# Altium schematic sheet elevator.SchDoc
size A4
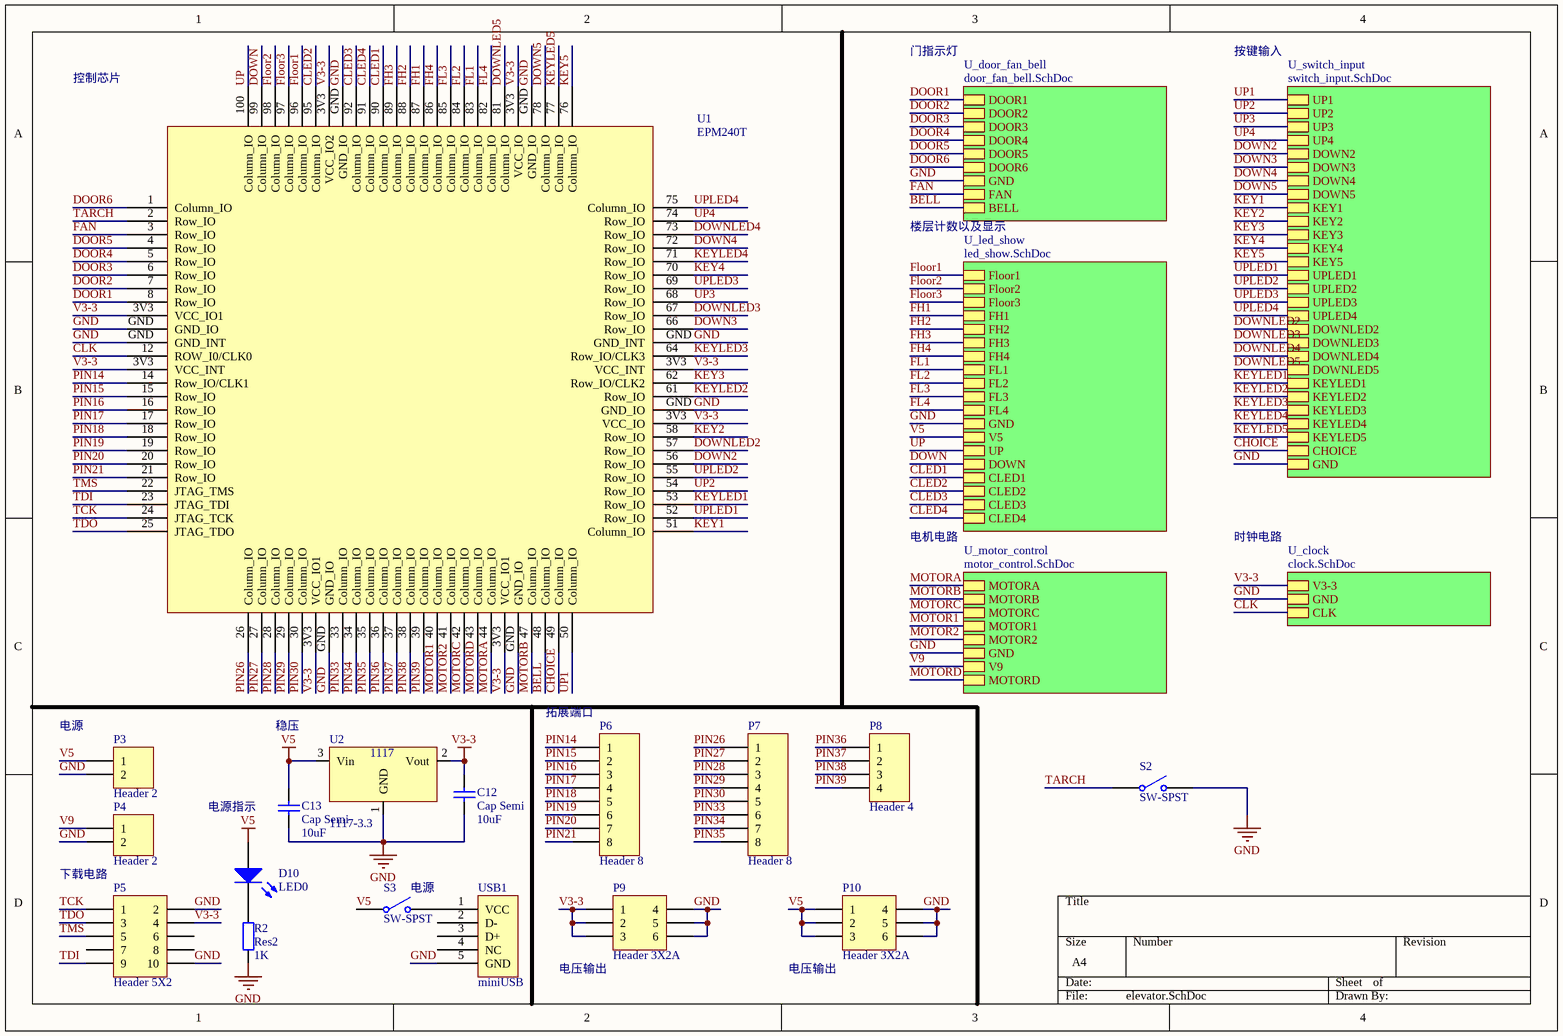
[diagram p0: elevator.SchDoc]

## Parts
C12  Cap Semi  value 10uF  [0603]
C13  Cap Semi  value 10uF  [0603]
D10  LED0  [1206]
P3  Header 2  [HDR1X2]
P4  Header 2  [HDR1X2]
P5  Header 5X2  [P_DC3]
P6  Header 8  [HDR1X8]
P7  Header 8  [HDR1X8]
P8  Header 4  [HDR1X4]
P9  Header 3X2A  [HDR2X3_CEN]
P10  Header 3X2A  [HDR2X3_CEN]
R2  Res2  value 1K  [0603]
S2  SW-SPST  [SW_TARCH]
S3  SW-SPST  [SIP3]
U1  EPM240T  [CPLD100]
U2  1117-3.3  [SOT-223]
USB1  miniUSB  [miniUSB]

## Sub-sheets
U_clock = clock.SchDoc: V3-3, GND, CLK
U_door_fan_bell = door_fan_bell.SchDoc: DOOR1, DOOR2, DOOR3, DOOR4, DOOR5, DOOR6, GND, FAN, BELL
U_led_show = led_show.SchDoc: Floor1, Floor2, Floor3, FH1, FH2, FH3, FH4, FL1, FL2, FL3, FL4, GND, V5, UP, DOWN, CLED1, CLED2, CLED3, CLED4
U_motor_control = motor_control.SchDoc: MOTORA, MOTORB, MOTORC, MOTOR1, MOTOR2, GND, V9, MOTORD
U_switch_input = switch_input.SchDoc: UP1, UP2, UP3, UP4, DOWN2, DOWN3, DOWN4, DOWN5, KEY1, KEY2, KEY3, KEY4, KEY5, UPLED1, UPLED2, UPLED3, UPLED4, DOWNLED2, DOWNLED3, DOWNLED4, DOWNLED5, KEYLED1, KEYLED2, KEYLED3, KEYLED4, KEYLED5, CHOICE, GND

## Nets
GND: C12.2 C13.2 P3.2 P4.2 P5.2 P5.10 P9.4 P9.5 P9.6 P10.4 P10.5 P10.6 R2.1 S2.2(NO) U1.GND(GND_IO) U2.1(GND) USB1.5(GND) ; sheet U_door_fan_bell/GND, sheet U_switch_input/GND, sheet U_clock/GND, sheet U_led_show/GND, sheet U_motor_control/GND
V3-3: C12.1 P5.4 P9.1 P9.2 P9.3 U1.3V3(VCC_IO1) U2.2(Vout) ; sheet U_clock/V3-3
V5: C13.1 D10.1(A) P3.1 P10.1 P10.2 P10.3 S3.1(COMMON) U2.3(Vin) ; sheet U_led_show/V5
BELL: U1.48(Column_IO) ; sheet U_door_fan_bell/BELL
CHOICE: U1.49(Column_IO) ; sheet U_switch_input/CHOICE
CLED1: U1.90(Column_IO) ; sheet U_led_show/CLED1
CLED2: U1.95(Column_IO) ; sheet U_led_show/CLED2
CLED3: U1.92(Column_IO) ; sheet U_led_show/CLED3
CLED4: U1.91(Column_IO) ; sheet U_led_show/CLED4
CLK: U1.12(ROW_I0/CLK0) ; sheet U_clock/CLK
DOOR1: U1.8(Row_IO) ; sheet U_door_fan_bell/DOOR1
DOOR2: U1.7(Row_IO) ; sheet U_door_fan_bell/DOOR2
DOOR3: U1.6(Row_IO) ; sheet U_door_fan_bell/DOOR3
DOOR4: U1.5(Row_IO) ; sheet U_door_fan_bell/DOOR4
DOOR5: U1.4(Row_IO) ; sheet U_door_fan_bell/DOOR5
DOOR6: U1.1(Column_IO) ; sheet U_door_fan_bell/DOOR6
DOWN: U1.99(Column_IO) ; sheet U_led_show/DOWN
DOWN2: U1.56(Row_IO) ; sheet U_switch_input/DOWN2
DOWN3: U1.66(Row_IO) ; sheet U_switch_input/DOWN3
DOWN4: U1.72(Row_IO) ; sheet U_switch_input/DOWN4
DOWN5: U1.78(Column_IO) ; sheet U_switch_input/DOWN5
DOWNLED2: U1.57(Row_IO) ; sheet U_switch_input/DOWNLED2
DOWNLED3: U1.67(Row_IO) ; sheet U_switch_input/DOWNLED3
DOWNLED4: U1.73(Row_IO) ; sheet U_switch_input/DOWNLED4
DOWNLED5: U1.81(Column_IO) ; sheet U_switch_input/DOWNLED5
FAN: U1.3(Row_IO) ; sheet U_door_fan_bell/FAN
FH1: U1.87(Column_IO) ; sheet U_led_show/FH1
FH2: U1.88(Column_IO) ; sheet U_led_show/FH2
FH3: U1.89(Column_IO) ; sheet U_led_show/FH3
FH4: U1.86(Column_IO) ; sheet U_led_show/FH4
FL1: U1.83(Column_IO) ; sheet U_led_show/FL1
FL2: U1.84(Column_IO) ; sheet U_led_show/FL2
FL3: U1.85(Column_IO) ; sheet U_led_show/FL3
FL4: U1.82(Column_IO) ; sheet U_led_show/FL4
Floor1: U1.96(Column_IO) ; sheet U_led_show/Floor1
Floor2: U1.98(Column_IO) ; sheet U_led_show/Floor2
Floor3: U1.97(Column_IO) ; sheet U_led_show/Floor3
KEY1: U1.51(Column_IO) ; sheet U_switch_input/KEY1
KEY2: U1.58(Row_IO) ; sheet U_switch_input/KEY2
KEY3: U1.62(Row_IO/CLK2) ; sheet U_switch_input/KEY3
KEY4: U1.70(Row_IO) ; sheet U_switch_input/KEY4
KEY5: U1.76(Column_IO) ; sheet U_switch_input/KEY5
KEYLED1: U1.53(Row_IO) ; sheet U_switch_input/KEYLED1
KEYLED2: U1.61(Row_IO) ; sheet U_switch_input/KEYLED2
KEYLED3: U1.64(Row_IO/CLK3) ; sheet U_switch_input/KEYLED3
KEYLED4: U1.71(Row_IO) ; sheet U_switch_input/KEYLED4
KEYLED5: U1.77(Column_IO) ; sheet U_switch_input/KEYLED5
MOTOR1: U1.40(Column_IO) ; sheet U_motor_control/MOTOR1
MOTOR2: U1.41(Column_IO) ; sheet U_motor_control/MOTOR2
MOTORA: U1.44(Column_IO) ; sheet U_motor_control/MOTORA
MOTORB: U1.47(Column_IO) ; sheet U_motor_control/MOTORB
MOTORC: U1.42(Column_IO) ; sheet U_motor_control/MOTORC
MOTORD: U1.43(Column_IO) ; sheet U_motor_control/MOTORD
PIN14: P6.1 U1.14(Row_IO/CLK1)
PIN15: P6.2 U1.15(Row_IO)
PIN16: P6.3 U1.16(Row_IO)
PIN17: P6.4 U1.17(Row_IO)
PIN18: P6.5 U1.18(Row_IO)
PIN19: P6.6 U1.19(Row_IO)
PIN20: P6.7 U1.20(Row_IO)
PIN21: P6.8 U1.21(Row_IO)
PIN26: P7.1 U1.26(Column_IO)
PIN27: P7.2 U1.27(Column_IO)
PIN28: P7.3 U1.28(Column_IO)
PIN29: P7.4 U1.29(Column_IO)
PIN30: P7.5 U1.30(Column_IO)
PIN33: P7.6 U1.33(Column_IO)
PIN34: P7.7 U1.34(Column_IO)
PIN35: P7.8 U1.35(Column_IO)
PIN36: P8.1 U1.36(Column_IO)
PIN37: P8.2 U1.37(Column_IO)
PIN38: P8.3 U1.38(Column_IO)
PIN39: P8.4 U1.39(Column_IO)
TARCH: S2.1(COMMON) U1.2(Row_IO)
TCK: P5.1 U1.24(JTAG_TCK)
TDI: P5.9 U1.23(JTAG_TDI)
TDO: P5.3 U1.25(JTAG_TDO)
TMS: P5.5 U1.22(JTAG_TMS)
UP: U1.100(Column_IO) ; sheet U_led_show/UP
UP1: U1.50(Column_IO) ; sheet U_switch_input/UP1
UP2: U1.54(Row_IO) ; sheet U_switch_input/UP2
UP3: U1.68(Row_IO) ; sheet U_switch_input/UP3
UP4: U1.74(Row_IO) ; sheet U_switch_input/UP4
UPLED1: U1.52(Row_IO) ; sheet U_switch_input/UPLED1
UPLED2: U1.55(Row_IO) ; sheet U_switch_input/UPLED2
UPLED3: U1.69(Row_IO) ; sheet U_switch_input/UPLED3
UPLED4: U1.75(Column_IO) ; sheet U_switch_input/UPLED4
V9: P4.1 ; sheet U_motor_control/V9
NetD10_2: D10.2(K) R2.2
NetS3_2: S3.2(NO) USB1.1(VCC)

Not connected (* = marked no-connect by the designer): P5 6 7 8; USB1 2(D-) 3(D+) 4(NC)

## Notes on the sheet
- 控制芯片
- 门指示灯
- 按键输入
- 楼层计数以及显示
- 电机电路
- 时钟电路
- (near P6) 拓展端口
- (near P3) 电源
- 稳压
- 电源指示
- 下载电路
- (near S3) 电源
- (near P9) 电压输出
- (near P10) 电压输出
- (in symbol 1117B) 1117

## Library data of the parts
C12 C13 = Cap Semi: Capacitor (Semiconductor SIM Model); Published: 8-Jun-2000; LatestRevisionDate: 17-Jul-2002; LatestRevisionNote: Re-released for DXP Platform.; PackageReference: C1206; Publisher: Altium Limited
D10 = LED0: Typical INFRARED GaAs LED; Published: 8-Jun-2000; LatestRevisionDate: 08-Jul-2005; LatestRevisionNote: Mech Layer 1 removed.; PackageReference: LED-0; Publisher: Altium Limited; PackageDescription: LED; 2 Leads
P3 P4 = Header 2: Header, 2-Pin; LatestRevisionDate: 17-Jul-2002; LatestRevisionNote: Re-released for DXP Platform.; Publisher: Altium Limited
P5 = Header 5X2: Header, 5-Pin, Dual row; LatestRevisionDate: 17-Jul-2002; LatestRevisionNote: Re-released for DXP Platform.; Publisher: Altium Limited
P6 P7 = Header 8: Header, 8-Pin; LatestRevisionDate: 17-Jul-2002; LatestRevisionNote: Re-released for DXP Platform.; Publisher: Altium Limited
P8 = Header 4: Header, 4-Pin; LatestRevisionDate: 17-Jul-2002; LatestRevisionNote: Re-released for DXP Platform.; Publisher: Altium Limited
P9 P10 = Header 3X2A: Header, 3-Pin, Dual row; LatestRevisionDate: 17-Jul-2002; LatestRevisionNote: Re-released for DXP Platform.; Publisher: Altium Limited
R2 = Res2: Resistor; Published: 8-Jun-2000; LatestRevisionDate: 17-Jul-2002; LatestRevisionNote: Re-released for DXP Platform.; PackageReference: AXIAL-0.4; Publisher: Altium Limited; PackageDescription: Axial Device, Thru-Hole; 2 Leads; 0.4 in Pin Spacing
S2 S3 = SW-SPST: Single-Pole, Single-Throw Switch; Published: 24-Mar-1999; LatestRevisionDate: 17-Jul-2002; LatestRevisionNote: Re-released for DXP Platform.; PackageReference: SPST-2; Publisher: Altium Limited; PackageDescription: Switch; 2 Leads
U1 = EPM240T1005
U2 = 1117B